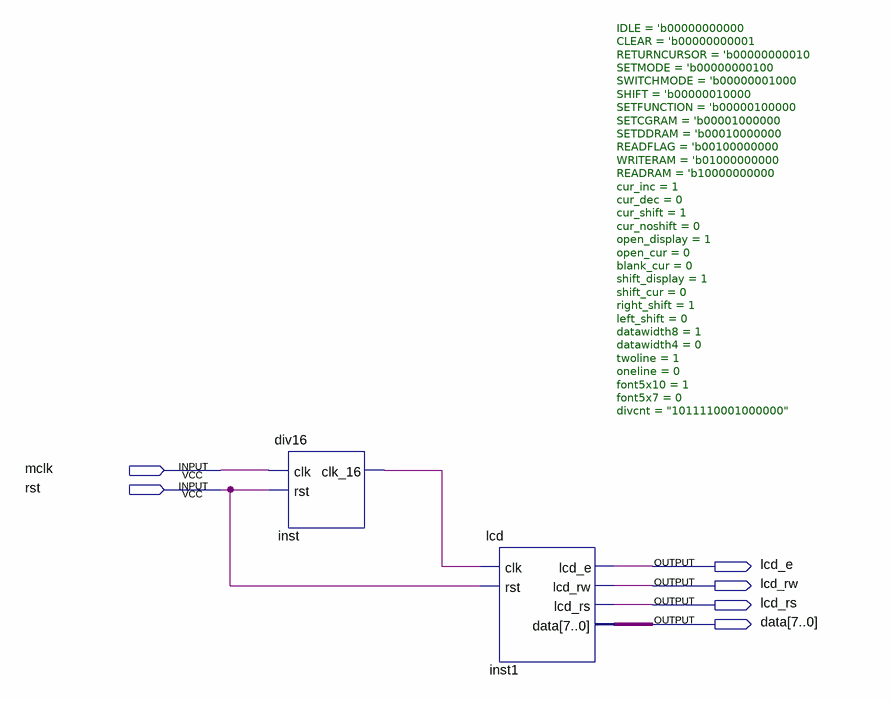
[diagram p0: schematic sheet]
// Quartus schematic lcd_v.bdf as structural Verilog: 2 symbols, 6 pins
module lcd_v (
  input  mclk,
  input  rst,
  output lcd_e,
  output lcd_rw,
  output lcd_rs,
  output [7:0] data
);

  wire inst_clk_16;

  div16 inst (.clk(mclk), .rst(rst), .clk_16(inst_clk_16));
  lcd #(.IDLE('b00000000000), .CLEAR('b00000000001), .RETURNCURSOR('b00000000010), .SETMODE('b00000000100), .SWITCHMODE('b00000001000), .SHIFT('b00000010000), .SETFUNCTION('b00000100000), .SETCGRAM('b00001000000), .SETDDRAM('b00010000000), .READFLAG('b00100000000), .WRITERAM('b01000000000), .READRAM('b10000000000), .cur_inc(1), .cur_dec(0), .cur_shift(1), .cur_noshift(0), .open_display(1), .open_cur(0), .blank_cur(0), .shift_display(1), .shift_cur(0), .right_shift(1), .left_shift(0), .datawidth8(1), .datawidth4(0), .twoline(1), .oneline(0), .font5x10(1), .font5x7(0), .divcnt("1011110001000000")) inst1 (
    .clk(inst_clk_16), .rst(rst), .lcd_e(lcd_e), .lcd_rw(lcd_rw), .lcd_rs(lcd_rs), .data(data));
endmodule
